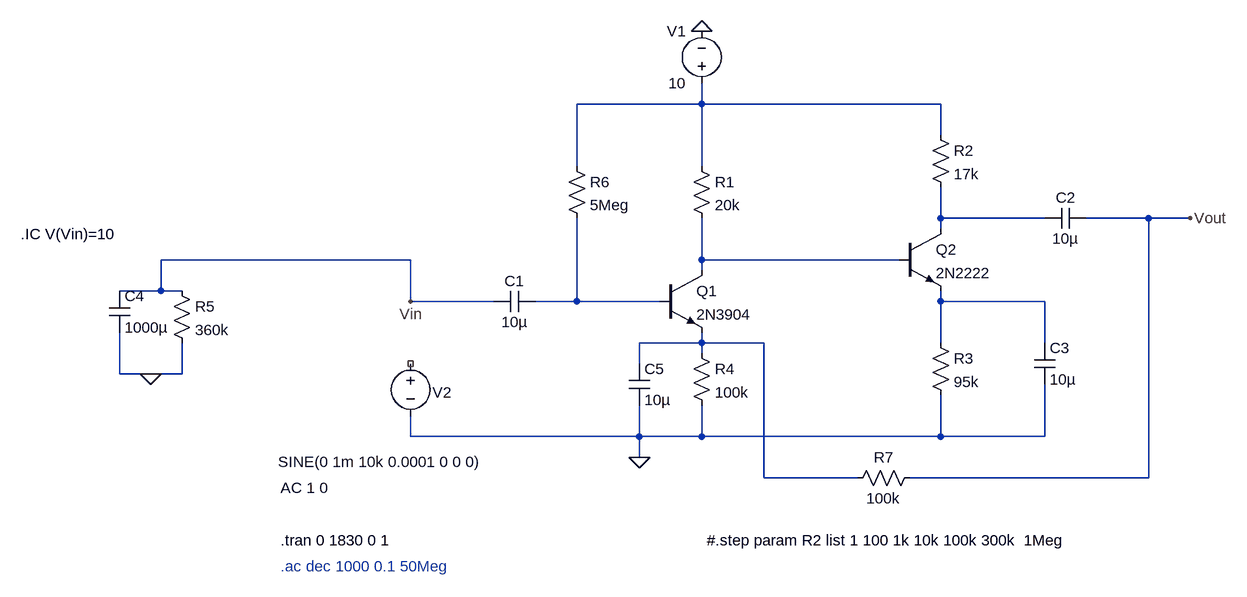
[diagram p0: schematic water_timer_with_q.asc]
water_timer_with_q.asc, the LTspice schematic file:
Version 4
SHEET 1 2036 840
WIRE 80 -160 80 -192
WIRE 80 -160 -112 -160
WIRE 448 -160 80 -160
WIRE 448 -112 448 -160
WIRE -112 -64 -112 -160
WIRE 80 -64 80 -160
WIRE 448 16 448 -32
WIRE 608 16 448 16
WIRE 768 16 672 16
WIRE 832 16 768 16
WIRE 448 32 448 16
WIRE -368 80 -752 80
WIRE 80 80 80 16
WIRE 384 80 80 80
WIRE 80 96 80 80
WIRE -752 128 -752 80
WIRE -752 128 -816 128
WIRE -720 128 -752 128
WIRE -368 144 -368 80
WIRE -240 144 -368 144
WIRE -112 144 -112 16
WIRE -112 144 -176 144
WIRE 16 144 -112 144
WIRE 448 144 448 128
WIRE 608 144 448 144
WIRE 80 208 80 192
WIRE 80 208 -16 208
WIRE 176 208 80 208
WIRE 448 208 448 144
WIRE 608 208 608 144
WIRE 80 224 80 208
WIRE -16 240 -16 208
WIRE -816 256 -816 192
WIRE -768 256 -816 256
WIRE -720 256 -720 208
WIRE -720 256 -768 256
WIRE -368 352 -368 320
WIRE -16 352 -16 304
WIRE -16 352 -368 352
WIRE 80 352 80 304
WIRE 80 352 -16 352
WIRE 448 352 448 288
WIRE 448 352 80 352
WIRE 608 352 608 272
WIRE 608 352 448 352
WIRE -16 384 -16 352
WIRE 176 416 176 208
WIRE 320 416 176 416
WIRE 768 416 768 16
WIRE 768 416 400 416
FLAG 80 -272 0
FLAG -16 384 0
FLAG 832 16 Vout
FLAG -368 144 Vin
FLAG -768 256 0
SYMBOL npn 16 96 R0
SYMATTR InstName Q1
SYMATTR Value 2N3904
SYMBOL npn 384 32 R0
SYMATTR InstName Q2
SYMATTR Value 2N2222
SYMBOL res 64 -80 R0
SYMATTR InstName R1
SYMATTR Value 20k
SYMBOL res 432 -128 R0
SYMATTR InstName R2
SYMATTR Value 17k
SYMBOL res 432 192 R0
SYMATTR InstName R3
SYMATTR Value 95k
SYMBOL res 64 208 R0
SYMATTR InstName R4
SYMATTR Value 100k
SYMBOL cap -240 160 R270
WINDOW 0 32 32 VTop 2
WINDOW 3 0 32 VBottom 2
SYMATTR InstName C1
SYMATTR Value 10µ
SYMBOL res -128 -80 R0
SYMATTR InstName R6
SYMATTR Value 5Meg
SYMBOL voltage 80 -176 R180
WINDOW 0 24 96 Left 2
WINDOW 3 24 16 Left 2
SYMATTR InstName V1
SYMATTR Value 10
SYMBOL voltage -368 224 R0
WINDOW 0 34 60 Left 2
WINDOW 3 -204 167 Left 2
WINDOW 123 -200 207 Left 2
WINDOW 39 0 0 Left 0
SYMATTR InstName V2
SYMATTR Value SINE(0 1m 10k 0.0001 0 0 0)
SYMATTR Value2 AC 1 0
SYMBOL cap 672 0 R90
WINDOW 0 0 32 VBottom 2
WINDOW 3 32 32 VTop 2
SYMATTR InstName C2
SYMATTR Value 10µ
SYMBOL cap 592 208 R0
SYMATTR InstName C3
SYMATTR Value 10µ
SYMBOL res 416 400 R90
WINDOW 0 0 56 VBottom 2
WINDOW 3 32 56 VTop 2
SYMATTR InstName R7
SYMATTR Value 100k
SYMBOL cap -32 240 R0
SYMATTR InstName C5
SYMATTR Value 10µ
SYMBOL cap -832 128 R0
SYMATTR InstName C4
SYMATTR Value 1000µ
SYMBOL res -736 112 R0
SYMATTR InstName R5
SYMATTR Value 360k
TEXT -568 512 Left 2 !.tran 0 1830 0 1
TEXT -568 552 Left 2 ;.ac dec 1000 0.1 50Meg
TEXT 88 512 Left 2 !#.step param R2 list 1 100 1k 10k 100k 300k  1Meg
TEXT -968 40 Left 2 !.IC V(Vin)=10

The netlist it stands for:
* water_timer_with_q.asc
Q1 N003 N004 N006 0 2N3904
Q2 N002 N003 N005 0 2N2222
R1 N001 N003 20k
R2 N001 N002 17k
R3 N005 0 95k
R4 N006 0 100k
C1 Vin N004 10µ
R6 N001 N004 5Meg
V1 N001 0 10
V2 NC_01 0 SINE(0 1m 10k 0.0001 0 0 0) AC 1 0
C2 Vout N002 10µ
C3 N005 0 10µ
R7 Vout N006 100k
C5 N006 0 10µ
C4 Vin 0 1000µ
R5 Vin 0 360k
.model NPN NPN
.model PNP PNP
.lib standard.bjt
.tran 0 1830 0 1
* .ac dec 1000 0.1 50Meg
#.step param R2 list 1 100 1k 10k 100k 300k  1Meg
.IC V(Vin)=10
.backanno
.end